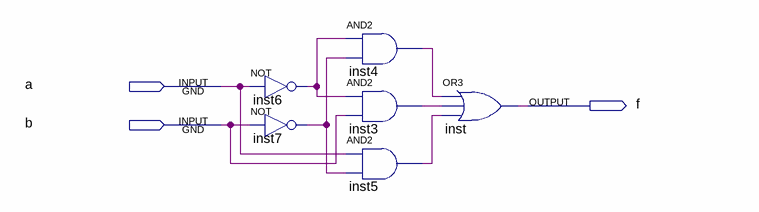
[diagram p0: schematic sheet]
// Quartus schematic 1-4-before.bdf as structural Verilog: 6 symbols, 3 pins
module \1-4-before  (
  input  a,
  input  b,
  output f
);

  wire inst3_out, inst4_out, inst5_out, inst6_out, inst7_out;

  not inst6 (inst6_out, a);
  not inst7 (inst7_out, b);
  and inst4 (inst4_out, inst6_out, inst7_out);
  and inst3 (inst3_out, inst6_out, b);
  and inst5 (inst5_out, a, inst7_out);
  or inst (f, inst4_out, inst3_out, inst5_out);
endmodule
